# EAGLE design Corner Board Rev3 (EAGLE 9.6.2)

## Sheet 1 of 2
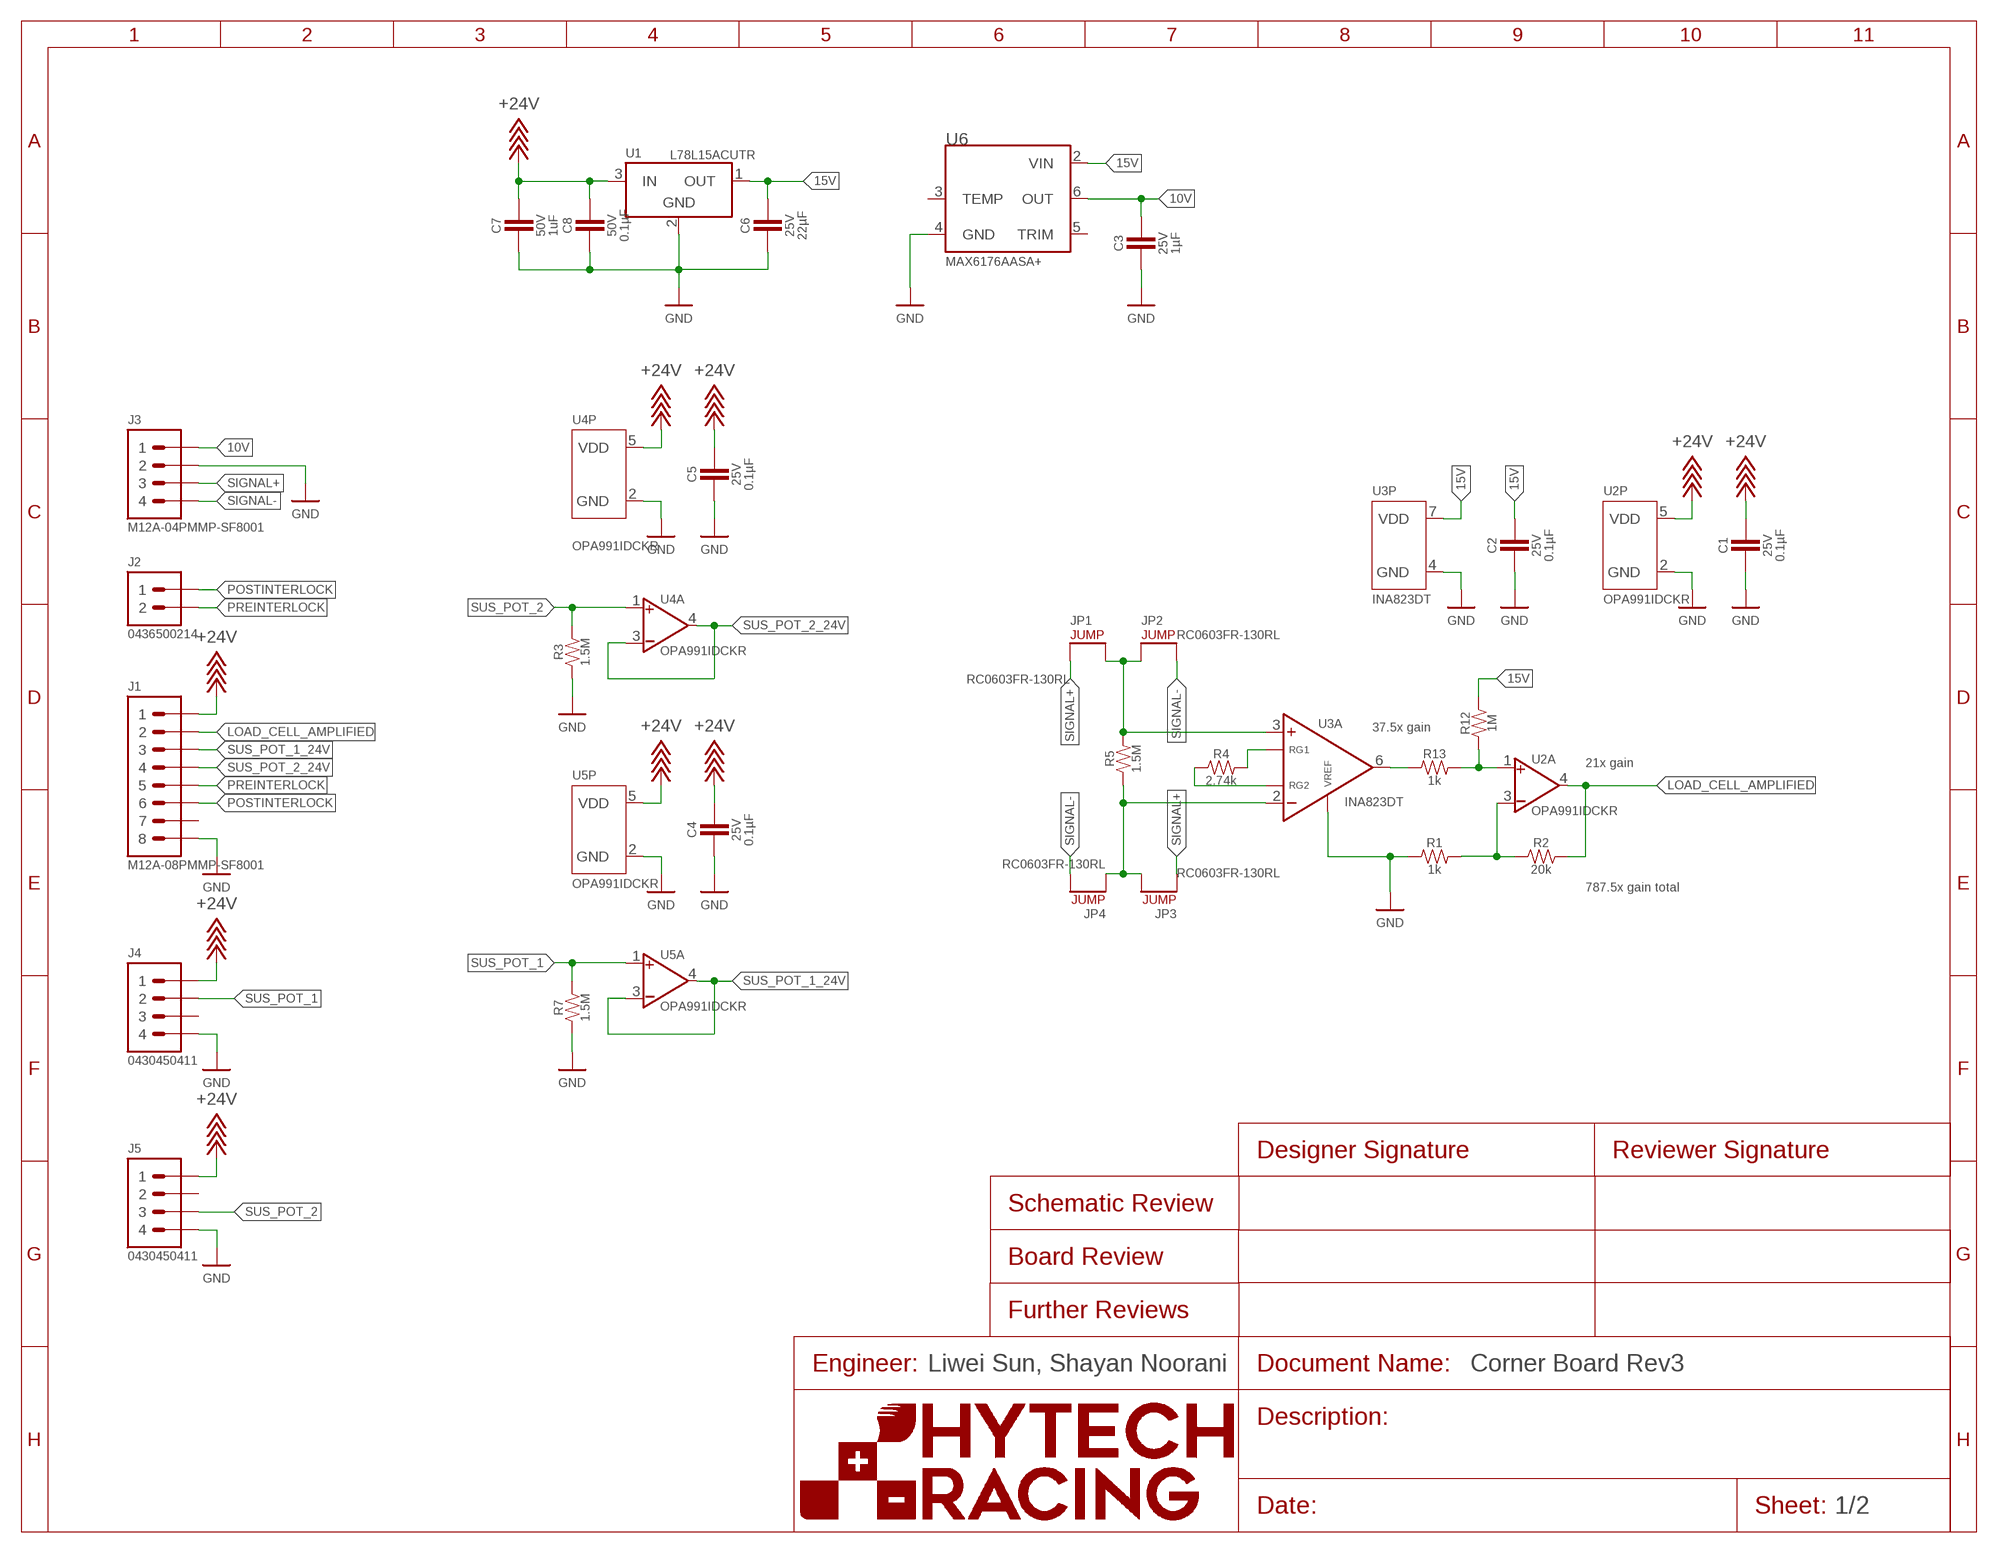
[diagram p0: schematic, sheet 1]
FRAME1 (FRAME): ENGINEER: Liwei Sun, Shayan Noorani

### Parts
C1  CAPACITOR_0603_25V_0.1UF  [0603-CAP]
C2  CAPACITOR_0603_25V_0.1UF  [0603-CAP]
C3  CAPACITOR_0603_25V_1UF  [0603-CAP]
C4  CAPACITOR_0603_25V_0.1UF  [0603-CAP]
C5  CAPACITOR_0603_25V_0.1UF  [0603-CAP]
C6  CAPACITOR_0805_25V_22UF  [0805-CAP]
C7  CAPACITOR_0603_50V_1UF  [0603-CAP]
C8  CAPACITOR_0603_50V_0.1UF  [0603-CAP]
J1  CONNECTOR-8_AMPHENOL_M12A_08PMMP_  [M12A-08PMMP]
J2  CONNECTOR-2_MICROFIT_SMD_RIGHTANGLE_02_SINGLE_BLACK  [MOLEX_MICROFIT_SMD_RIGHTANGLE_02_SINGLE]
J3  CONNECTOR-4_AMPHENOL_M12A_04PMMP_  [M12A-04PMMP]
J4  CONNECTOR-4_μF_S_RA_  [MOLEX_MICROFIT_SMD_RIGHTANGLE_04_DUAL]
J5  CONNECTOR-4_μF_S_RA_  [MOLEX_MICROFIT_SMD_RIGHTANGLE_04_DUAL]
JP1  JUMPER_0603_  [0603-RES]
JP2  JUMPER_0603_  [0603-RES]
JP3  JUMPER_0603_  [0603-RES]
JP4  JUMPER_0603_  [0603-RES]
R1  RESISTOR_0603_1K  [0603-RES]
R2  RESISTOR_0603_20K  [0603-RES]
R3  RESISTOR_0603_1.5M  [0603-RES]
R4  RESISTOR_0603_2.74K  [0603-RES]
R5  RESISTOR_0603_1.5M  [0603-RES]
R7  RESISTOR_0603_1.5M  [0603-RES]
R12  RESISTOR_0603_1M  [0603-RES]
R13  RESISTOR_0603_1K  [0603-RES]
U1  VOLTAGE_REGULATOR_SOT-89REVERSE_  [SOT-89]
U2  OPAMP_1_CHANNEL_OPA991  [SC-70-5]
U3  INA823DT  [SOIC-08(NARROW,0.15")]
U4  OPAMP_1_CHANNEL_OPA991  [SC-70-5]
U5  OPAMP_1_CHANNEL_OPA991  [SC-70-5]
U6  VOLTAGE_REFERENCE_SOIC-8_10V  [SOIC-08(NARROW,0.15")]

### Nets
10V: C3.1 J3.1 U6.6(OUT)
15V: C2.1 C6.1 R12.2 U1.1(OUT) U3.7(P:VDD) U6.2(VIN)
+24V: C1.1 C4.1 C5.1 C7.1 C8.1 J1.1 J4.1 J5.1 U1.3(IN) U2.5(P:VDD) U4.5(P:VDD) U5.5(P:VDD)
GND: C1.2 C2.2 C3.2 C4.2 C5.2 C6.2 C7.2 C8.2 J1.8 J3.2 J4.4 J5.4 R1.1 R3.1 R7.1 U1.2(GND) U2.2(P:GND) U3.4(P:GND) U3.5(A:VREF) U4.2(P:GND) U5.2(P:GND) U6.4(GND)
LOAD_CELL_AMPLIFIED: J1.2 R2.2 U2.4(A:VOUT)
N$1: R1.2 R2.1 U2.3(A:VIN-)
N$2: R4.2 U3.1(A:RG1)
N$3: R13.1 U3.6(A:VOUT)
N$4: R4.1 U3.8(A:RG2)
N$6: R12.1 R13.2 U2.1(A:VIN+)
N$7: JP3.2 JP4.1 R5.1 U3.2(A:VIN-)
N$9: JP1.2 JP2.1 R5.2 U3.3(A:VIN+)
POSTINTERLOCK: J1.6 J2.1
PREINTERLOCK: J1.5 J2.2
SIGNAL+: J3.3 JP1.1 JP3.1
SIGNAL-: J3.4 JP2.2 JP4.2
SUS_POT_1: J4.2 R7.2 U5.1(A:VIN+)
SUS_POT_1_24V: J1.3 U5.3(A:VIN-) U5.4(A:VOUT)
SUS_POT_2: J5.3 R3.2 U4.1(A:VIN+)
SUS_POT_2_24V: J1.4 U4.3(A:VIN-) U4.4(A:VOUT)
Unconnected: J1.7 J4.3 J5.2 U6.3(TEMP) U6.5(TRIM)

### Notes on the sheet
- 37.5x gain
- 21x gain
- 787.5x gain total

## Sheet 2 of 2
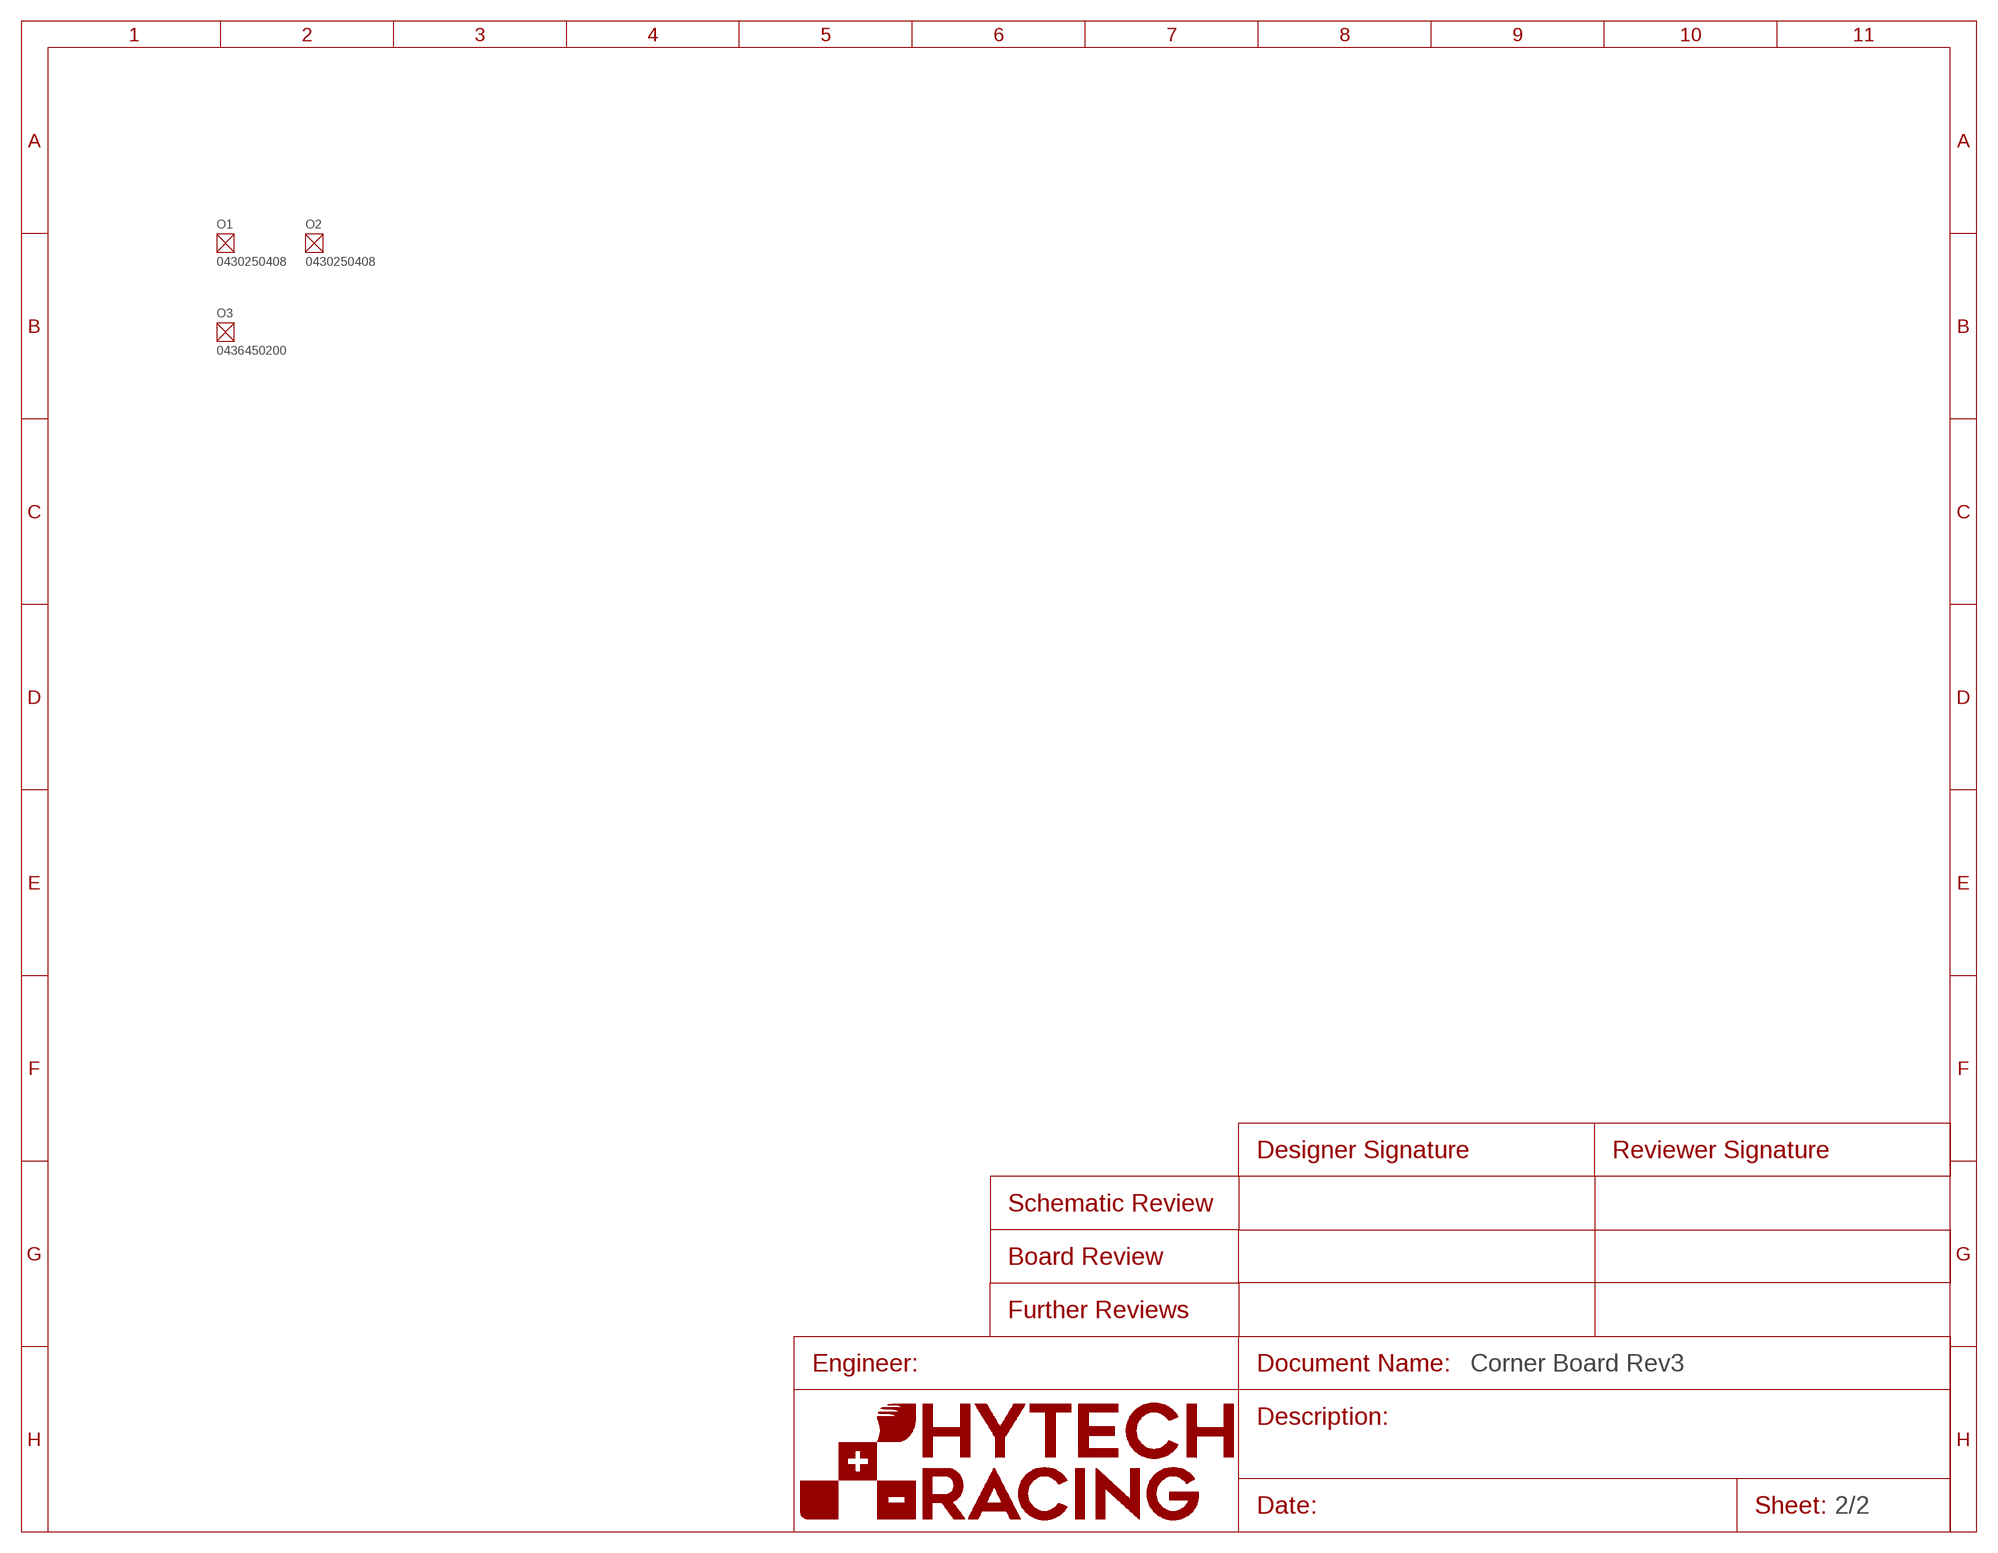
[diagram p1: schematic, sheet 2]
O1 (RECEPTACLE-4_MICROFIT): DKPN: WM11225-ND; MANUFACTURER: Molex; MOPN: 538-43025-0408; MPN: 0430250408
O2 (RECEPTACLE-4_MICROFIT): DKPN: WM11225-ND; MANUFACTURER: Molex; MOPN: 538-43025-0408; MPN: 0430250408
O3 (RECEPTACLE-2_MICROFIT): DKPN: WM1845-ND; MANUFACTURER: Molex; MOPN: 538-43645-0200; MPN: 0436450200

## Library data of the parts
C1 C2 C4 C5 = HyTechDevices:CAPACITOR_?_*: Capacitor, Non-Polarized VJ...1BC Series Datasheet <https://www.mouser.com/datasheet/2/427/vjw1bcbascomseries-1762447.pdf> Samsung Datasheet <https://www.mouser.com/datasheet/2/585/MLCC-1837944.pdf> Walsin Datasheet <https://www.mouser.com/datasheet/2/210/WTC_MLCC_General_Purpose-1534899.pdf> GRM188R61A226ME15D <https://www.mouser.com/datasheet/2/281/1/GRM188R61A226ME15_02A-1985787.pdf> GRM188R61E106MA73D <https://www.mouser.com/datasheet/2/281/1/GRM188R61E106MA73_01A-1985806.pdf> 885012006013 <https://www.mouser.com/datasheet/2/445/885012006013-1726946.pdf> 2220Y6300105KXTWS2 <https://www.mouser.com/datasheet/2/218/SMD_High_and_Std_StackiCap_P62-1825512.pdf> Yageo Class 2, X5R <https://www.mouser.com/datasheet/2/447/UPY_GPHC_X5R_4V_to_50V_26-1827097.pdf> TDK C Series <https://www.mouser.com/ProductDetail/TDK/C3216X5R1V226M160AC?qs=%2Fha2pyFadujbcx9jh7lYl%2F4NeMoXFhdc8AqVWNq4wW6M2y7zl6GzBuhgtI0ngznN> AVX Automotive MLCC <https://www.mouser.com/datasheet/2/40/AutoMLCC-777028.pdf> KEMET X7R Series <https://www.mouser.com/datasheet/2/212/KEM_C1002_X7R_SMD-1102033.pdf> Kyocera AVX <https://www.mouser.com/datasheet/2/40/C0GNP0_Dielectric-951274.pdf> GRM21BR61H <https://www.mouser.com/datasheet/2/281/1/GRM21BR61H106KE43_01A-1986884.pdf> C1812W104KDRACTU <https://www.mouser.com/datasheet/2/212/KEM_C1034_X7R_HV_ARC_SMD-1101730.pdf>; CAPACITANCE: 0.1µF; DKPN: 1276-1006-1-ND; MANUFACTURER: Samsung Electro-Mechanics; MOPN: 187-CL10B104KA8NNNC; MPN: CL10B104KA8NNNC; TOLERANCE: 10%; VOLTAGE: 25V
C3 = HyTechDevices:CAPACITOR_?_*: Capacitor, Non-Polarized VJ...1BC Series Datasheet <https://www.mouser.com/datasheet/2/427/vjw1bcbascomseries-1762447.pdf> Samsung Datasheet <https://www.mouser.com/datasheet/2/585/MLCC-1837944.pdf> Walsin Datasheet <https://www.mouser.com/datasheet/2/210/WTC_MLCC_General_Purpose-1534899.pdf> GRM188R61A226ME15D <https://www.mouser.com/datasheet/2/281/1/GRM188R61A226ME15_02A-1985787.pdf> GRM188R61E106MA73D <https://www.mouser.com/datasheet/2/281/1/GRM188R61E106MA73_01A-1985806.pdf> 885012006013 <https://www.mouser.com/datasheet/2/445/885012006013-1726946.pdf> 2220Y6300105KXTWS2 <https://www.mouser.com/datasheet/2/218/SMD_High_and_Std_StackiCap_P62-1825512.pdf> Yageo Class 2, X5R <https://www.mouser.com/datasheet/2/447/UPY_GPHC_X5R_4V_to_50V_26-1827097.pdf> TDK C Series <https://www.mouser.com/ProductDetail/TDK/C3216X5R1V226M160AC?qs=%2Fha2pyFadujbcx9jh7lYl%2F4NeMoXFhdc8AqVWNq4wW6M2y7zl6GzBuhgtI0ngznN> AVX Automotive MLCC <https://www.mouser.com/datasheet/2/40/AutoMLCC-777028.pdf> KEMET X7R Series <https://www.mouser.com/datasheet/2/212/KEM_C1002_X7R_SMD-1102033.pdf> Kyocera AVX <https://www.mouser.com/datasheet/2/40/C0GNP0_Dielectric-951274.pdf> GRM21BR61H <https://www.mouser.com/datasheet/2/281/1/GRM21BR61H106KE43_01A-1986884.pdf> C1812W104KDRACTU <https://www.mouser.com/datasheet/2/212/KEM_C1034_X7R_HV_ARC_SMD-1101730.pdf>; CAPACITANCE: 1µF; DKPN: 1276-1184-1-ND; MANUFACTURER: Samsung Electro-Mechanics; MOPN: 187-CL10B105KA8NNNC; MPN: CL10B105KA8NNNC; TOLERANCE: 10%; VOLTAGE: 25V
C6 = HyTechDevices:CAPACITOR_?_*: Capacitor, Non-Polarized VJ...1BC Series Datasheet <https://www.mouser.com/datasheet/2/427/vjw1bcbascomseries-1762447.pdf> Samsung Datasheet <https://www.mouser.com/datasheet/2/585/MLCC-1837944.pdf> Walsin Datasheet <https://www.mouser.com/datasheet/2/210/WTC_MLCC_General_Purpose-1534899.pdf> GRM188R61A226ME15D <https://www.mouser.com/datasheet/2/281/1/GRM188R61A226ME15_02A-1985787.pdf> GRM188R61E106MA73D <https://www.mouser.com/datasheet/2/281/1/GRM188R61E106MA73_01A-1985806.pdf> 885012006013 <https://www.mouser.com/datasheet/2/445/885012006013-1726946.pdf> 2220Y6300105KXTWS2 <https://www.mouser.com/datasheet/2/218/SMD_High_and_Std_StackiCap_P62-1825512.pdf> Yageo Class 2, X5R <https://www.mouser.com/datasheet/2/447/UPY_GPHC_X5R_4V_to_50V_26-1827097.pdf> TDK C Series <https://www.mouser.com/ProductDetail/TDK/C3216X5R1V226M160AC?qs=%2Fha2pyFadujbcx9jh7lYl%2F4NeMoXFhdc8AqVWNq4wW6M2y7zl6GzBuhgtI0ngznN> AVX Automotive MLCC <https://www.mouser.com/datasheet/2/40/AutoMLCC-777028.pdf> KEMET X7R Series <https://www.mouser.com/datasheet/2/212/KEM_C1002_X7R_SMD-1102033.pdf> Kyocera AVX <https://www.mouser.com/datasheet/2/40/C0GNP0_Dielectric-951274.pdf> GRM21BR61H <https://www.mouser.com/datasheet/2/281/1/GRM21BR61H106KE43_01A-1986884.pdf> C1812W104KDRACTU <https://www.mouser.com/datasheet/2/212/KEM_C1034_X7R_HV_ARC_SMD-1101730.pdf>; CAPACITANCE: 22µF; DKPN: 311-1903-1-ND; MANUFACTURER: Yageo; MOPN: 603-CC805MKX5R8BB226; MPN: CC0805MKX5R8BB226; TOLERANCE: 20%; VOLTAGE: 25V
C7 = HyTechDevices:CAPACITOR_?_*: Capacitor, Non-Polarized VJ...1BC Series Datasheet <https://www.mouser.com/datasheet/2/427/vjw1bcbascomseries-1762447.pdf> Samsung Datasheet <https://www.mouser.com/datasheet/2/585/MLCC-1837944.pdf> Walsin Datasheet <https://www.mouser.com/datasheet/2/210/WTC_MLCC_General_Purpose-1534899.pdf> GRM188R61A226ME15D <https://www.mouser.com/datasheet/2/281/1/GRM188R61A226ME15_02A-1985787.pdf> GRM188R61E106MA73D <https://www.mouser.com/datasheet/2/281/1/GRM188R61E106MA73_01A-1985806.pdf> 885012006013 <https://www.mouser.com/datasheet/2/445/885012006013-1726946.pdf> 2220Y6300105KXTWS2 <https://www.mouser.com/datasheet/2/218/SMD_High_and_Std_StackiCap_P62-1825512.pdf> Yageo Class 2, X5R <https://www.mouser.com/datasheet/2/447/UPY_GPHC_X5R_4V_to_50V_26-1827097.pdf> TDK C Series <https://www.mouser.com/ProductDetail/TDK/C3216X5R1V226M160AC?qs=%2Fha2pyFadujbcx9jh7lYl%2F4NeMoXFhdc8AqVWNq4wW6M2y7zl6GzBuhgtI0ngznN> AVX Automotive MLCC <https://www.mouser.com/datasheet/2/40/AutoMLCC-777028.pdf> KEMET X7R Series <https://www.mouser.com/datasheet/2/212/KEM_C1002_X7R_SMD-1102033.pdf> Kyocera AVX <https://www.mouser.com/datasheet/2/40/C0GNP0_Dielectric-951274.pdf> GRM21BR61H <https://www.mouser.com/datasheet/2/281/1/GRM21BR61H106KE43_01A-1986884.pdf> C1812W104KDRACTU <https://www.mouser.com/datasheet/2/212/KEM_C1034_X7R_HV_ARC_SMD-1101730.pdf>; CAPACITANCE: 1uF; DKPN: 587-2400-2-ND; MANUFACTURER: Taiyo Yuden; MOPN: 963-UMK107BJ105KA-T; MPN: UMK107BJ105KA-T; TOLERANCE: 10%; VOLTAGE: 50V
C8 = HyTechDevices:CAPACITOR_?_*: Capacitor, Non-Polarized VJ...1BC Series Datasheet <https://www.mouser.com/datasheet/2/427/vjw1bcbascomseries-1762447.pdf> Samsung Datasheet <https://www.mouser.com/datasheet/2/585/MLCC-1837944.pdf> Walsin Datasheet <https://www.mouser.com/datasheet/2/210/WTC_MLCC_General_Purpose-1534899.pdf> GRM188R61A226ME15D <https://www.mouser.com/datasheet/2/281/1/GRM188R61A226ME15_02A-1985787.pdf> GRM188R61E106MA73D <https://www.mouser.com/datasheet/2/281/1/GRM188R61E106MA73_01A-1985806.pdf> 885012006013 <https://www.mouser.com/datasheet/2/445/885012006013-1726946.pdf> 2220Y6300105KXTWS2 <https://www.mouser.com/datasheet/2/218/SMD_High_and_Std_StackiCap_P62-1825512.pdf> Yageo Class 2, X5R <https://www.mouser.com/datasheet/2/447/UPY_GPHC_X5R_4V_to_50V_26-1827097.pdf> TDK C Series <https://www.mouser.com/ProductDetail/TDK/C3216X5R1V226M160AC?qs=%2Fha2pyFadujbcx9jh7lYl%2F4NeMoXFhdc8AqVWNq4wW6M2y7zl6GzBuhgtI0ngznN> AVX Automotive MLCC <https://www.mouser.com/datasheet/2/40/AutoMLCC-777028.pdf> KEMET X7R Series <https://www.mouser.com/datasheet/2/212/KEM_C1002_X7R_SMD-1102033.pdf> Kyocera AVX <https://www.mouser.com/datasheet/2/40/C0GNP0_Dielectric-951274.pdf> GRM21BR61H <https://www.mouser.com/datasheet/2/281/1/GRM21BR61H106KE43_01A-1986884.pdf> C1812W104KDRACTU <https://www.mouser.com/datasheet/2/212/KEM_C1034_X7R_HV_ARC_SMD-1101730.pdf>; CAPACITANCE: 0.1µF; DKPN: 311-1344-1-ND; MANUFACTURER: Yageo; MOPN: 603-CC603KRX7R9BB104; MPN: CC0603KRX7R9BB104; TOLERANCE: 10%; VOLTAGE: 50V
J1 = HyTechDevices:CONNECTOR-8_?_*: 8 Pin Connector; DKPN: 1754-1026-ND; MANUFACTURER: Amphenol LTW; MOPN: 523-M12A08PMMPSF8001; MPN: M12A-08PMMP-SF8001
J2 = HyTechDevices:CONNECTOR-2_?_*: 2 Pin Connector; DKPN: WM14310CT-ND; MANUFACTURER: Molex; MOPN: 538-43650-0214; MPN: 0436500214
J3 = HyTechDevices:CONNECTOR-4_?_*: 4 Pin Connector; DKPN: 1754-1007-ND; MANUFACTURER: Amphenol; MPN: M12A-04PMMP-SF8001
J4 J5 = HyTechDevices:CONNECTOR-4_?_*: 4 Pin Connector; DKPN: WM1832CT-ND; MANUFACTURER: Molex; MOPN: 538-0430450411; MPN: 0430450411
JP1-JP4 = HyTechDevices:JUMPER_?_*: 2 Pin Connector; DKPN: 13-RC0603FR-130RLTR-ND; MANUFACTURER: YAGEO; MOPN: 603-RC0603FR-130RL; MPN: RC0603FR-130RL
R1 R13 = HyTechDevices:RESISTOR_?_*: Resistor PWR163 Series <https://www.mouser.com/datasheet/2/54/pwr163-777985.pdf> AC Series <https://www.mouser.com/datasheet/2/447/Yageo_PYu_AC_51_RoHS_L_7_1714230-1874691.pdf> PU Series <https://www.mouser.com/datasheet/2/447/PYu-PU_51_RoHS_L_6-1504619.pdf> ERA Series <https://www.mouser.com/datasheet/2/315/AOA0000C307-1149632.pdf> PWR263 Series <https://www.mouser.com/datasheet/2/54/pwr263s_35-778069.pdf> KTR Series <https://www.mouser.com/datasheet/2/348/ROHM_S_A0011075115_1-2563276.pdf> RC Series <https://www.mouser.com/datasheet/2/447/Yageo_03_18_2021_PYu_RC_Group_51_RoHS_L_11-2199992.pdf> ERJ PB3, PB6 Series <https://www.mouser.com/datasheet/2/315/AOA0000C328-1530132.pdf> ERJ PA2, P03, PA3, P06, P08, P14 Series <https://www.mouser.com/datasheet/2/315/AOA0000C331-1141874.pdf> B20 Series <https://www.ohmite.com/assets/docs/res_200.pdf?r=false> TE Connectivity/Holsworthy RN73 Series <https://www.mouser.com/datasheet/2/418/4/NG_DS_1773270_M-604713.pdf> Vishay Dale D/CRCW e3 <https://www.mouser.com/datasheet/2/427/dcrcwe3-1762152.pdf> Ohmite B20 <https://www.ohmite.com/assets/docs/res_200.pdf?r=false>; DKPN: 1712-CPF-A-0603B1K0ETR-ND; MANUFACTURER: TE Connectivity Passive Product; MOPN: 279-CPF-A-0603B1K0E; MPN: CPF-A-0603B1K0E; POWER: 0.0625W; RESISTANCE: 1k; TOLERANCE: 0.1%; VOLTAGE_CONTINUOUS: 7.9V; VOLTAGE_MAX: 50V
R2 = HyTechDevices:RESISTOR_?_*: Resistor PWR163 Series <https://www.mouser.com/datasheet/2/54/pwr163-777985.pdf> AC Series <https://www.mouser.com/datasheet/2/447/Yageo_PYu_AC_51_RoHS_L_7_1714230-1874691.pdf> PU Series <https://www.mouser.com/datasheet/2/447/PYu-PU_51_RoHS_L_6-1504619.pdf> ERA Series <https://www.mouser.com/datasheet/2/315/AOA0000C307-1149632.pdf> PWR263 Series <https://www.mouser.com/datasheet/2/54/pwr263s_35-778069.pdf> KTR Series <https://www.mouser.com/datasheet/2/348/ROHM_S_A0011075115_1-2563276.pdf> RC Series <https://www.mouser.com/datasheet/2/447/Yageo_03_18_2021_PYu_RC_Group_51_RoHS_L_11-2199992.pdf> ERJ PB3, PB6 Series <https://www.mouser.com/datasheet/2/315/AOA0000C328-1530132.pdf> ERJ PA2, P03, PA3, P06, P08, P14 Series <https://www.mouser.com/datasheet/2/315/AOA0000C331-1141874.pdf> B20 Series <https://www.ohmite.com/assets/docs/res_200.pdf?r=false> TE Connectivity/Holsworthy RN73 Series <https://www.mouser.com/datasheet/2/418/4/NG_DS_1773270_M-604713.pdf> Vishay Dale D/CRCW e3 <https://www.mouser.com/datasheet/2/427/dcrcwe3-1762152.pdf> Ohmite B20 <https://www.ohmite.com/assets/docs/res_200.pdf?r=false>; DKPN: 311-20.0KHRTR-ND; MANUFACTURER: Yageo; MOPN: 603-RC0603FR-0720KL; MPN: RC0603FR-0720KL; POWER: 0.1 W; RESISTANCE: 20k; TOLERANCE: 1%; VOLTAGE_CONTINUOUS: 44.72V; VOLTAGE_MAX: 75V
R3 R5 R7 = HyTechDevices:RESISTOR_?_*: Resistor PWR163 Series <https://www.mouser.com/datasheet/2/54/pwr163-777985.pdf> AC Series <https://www.mouser.com/datasheet/2/447/Yageo_PYu_AC_51_RoHS_L_7_1714230-1874691.pdf> PU Series <https://www.mouser.com/datasheet/2/447/PYu-PU_51_RoHS_L_6-1504619.pdf> ERA Series <https://www.mouser.com/datasheet/2/315/AOA0000C307-1149632.pdf> PWR263 Series <https://www.mouser.com/datasheet/2/54/pwr263s_35-778069.pdf> KTR Series <https://www.mouser.com/datasheet/2/348/ROHM_S_A0011075115_1-2563276.pdf> RC Series <https://www.mouser.com/datasheet/2/447/Yageo_03_18_2021_PYu_RC_Group_51_RoHS_L_11-2199992.pdf> ERJ PB3, PB6 Series <https://www.mouser.com/datasheet/2/315/AOA0000C328-1530132.pdf> ERJ PA2, P03, PA3, P06, P08, P14 Series <https://www.mouser.com/datasheet/2/315/AOA0000C331-1141874.pdf> B20 Series <https://www.ohmite.com/assets/docs/res_200.pdf?r=false> TE Connectivity/Holsworthy RN73 Series <https://www.mouser.com/datasheet/2/418/4/NG_DS_1773270_M-604713.pdf> Vishay Dale D/CRCW e3 <https://www.mouser.com/datasheet/2/427/dcrcwe3-1762152.pdf> Ohmite B20 <https://www.ohmite.com/assets/docs/res_200.pdf?r=false>; DKPN: 311-1.50MHRCT-ND; MANUFACTURER: Yageo; MOPN: 603-RC0603FR-071M5L; MPN: RC0603FR-071M5L; POWER: 0.1W; RESISTANCE: 1.5M; TOLERANCE: 1%; VOLTAGE_CONTINUOUS: 75V; VOLTAGE_MAX: 75V
R4 = HyTechDevices:RESISTOR_?_*: Resistor PWR163 Series <https://www.mouser.com/datasheet/2/54/pwr163-777985.pdf> AC Series <https://www.mouser.com/datasheet/2/447/Yageo_PYu_AC_51_RoHS_L_7_1714230-1874691.pdf> PU Series <https://www.mouser.com/datasheet/2/447/PYu-PU_51_RoHS_L_6-1504619.pdf> ERA Series <https://www.mouser.com/datasheet/2/315/AOA0000C307-1149632.pdf> PWR263 Series <https://www.mouser.com/datasheet/2/54/pwr263s_35-778069.pdf> KTR Series <https://www.mouser.com/datasheet/2/348/ROHM_S_A0011075115_1-2563276.pdf> RC Series <https://www.mouser.com/datasheet/2/447/Yageo_03_18_2021_PYu_RC_Group_51_RoHS_L_11-2199992.pdf> ERJ PB3, PB6 Series <https://www.mouser.com/datasheet/2/315/AOA0000C328-1530132.pdf> ERJ PA2, P03, PA3, P06, P08, P14 Series <https://www.mouser.com/datasheet/2/315/AOA0000C331-1141874.pdf> B20 Series <https://www.ohmite.com/assets/docs/res_200.pdf?r=false> TE Connectivity/Holsworthy RN73 Series <https://www.mouser.com/datasheet/2/418/4/NG_DS_1773270_M-604713.pdf> Vishay Dale D/CRCW e3 <https://www.mouser.com/datasheet/2/427/dcrcwe3-1762152.pdf> Ohmite B20 <https://www.ohmite.com/assets/docs/res_200.pdf?r=false>; DKPN: P20020CT-ND; MANUFACTURER: Panasonic Electronic Components; MOPN: 667-ERJ-PB3B2741V; MPN: ERJ-PB3B2741V; POWER: 0.2W; RESISTANCE: 2.74k; TOLERANCE: 0.1%; VOLTAGE_CONTINUOUS: 23.41V; VOLTAGE_MAX: 150V
R12 = HyTechDevices:RESISTOR_?_*: Resistor PWR163 Series <https://www.mouser.com/datasheet/2/54/pwr163-777985.pdf> AC Series <https://www.mouser.com/datasheet/2/447/Yageo_PYu_AC_51_RoHS_L_7_1714230-1874691.pdf> PU Series <https://www.mouser.com/datasheet/2/447/PYu-PU_51_RoHS_L_6-1504619.pdf> ERA Series <https://www.mouser.com/datasheet/2/315/AOA0000C307-1149632.pdf> PWR263 Series <https://www.mouser.com/datasheet/2/54/pwr263s_35-778069.pdf> KTR Series <https://www.mouser.com/datasheet/2/348/ROHM_S_A0011075115_1-2563276.pdf> RC Series <https://www.mouser.com/datasheet/2/447/Yageo_03_18_2021_PYu_RC_Group_51_RoHS_L_11-2199992.pdf> ERJ PB3, PB6 Series <https://www.mouser.com/datasheet/2/315/AOA0000C328-1530132.pdf> ERJ PA2, P03, PA3, P06, P08, P14 Series <https://www.mouser.com/datasheet/2/315/AOA0000C331-1141874.pdf> B20 Series <https://www.ohmite.com/assets/docs/res_200.pdf?r=false> TE Connectivity/Holsworthy RN73 Series <https://www.mouser.com/datasheet/2/418/4/NG_DS_1773270_M-604713.pdf> Vishay Dale D/CRCW e3 <https://www.mouser.com/datasheet/2/427/dcrcwe3-1762152.pdf> Ohmite B20 <https://www.ohmite.com/assets/docs/res_200.pdf?r=false>; DKPN: 311-1.00MHRCT-ND; MANUFACTURER: Yageo; MOPN: 603-RC0603FR-071ML; MPN: RC0603FR-071ML; POWER: 0.1W; RESISTANCE: 1M; TOLERANCE: 1%; VOLTAGE_CONTINUOUS: 75V; VOLTAGE_MAX: 75V
U1 = HyTechDevices:VOLTAGE_REGULATOR_?_*: Voltage Regulators LDL1117S50R Datasheet <https://www.mouser.com/datasheet/2/389/dm00366442-1799212.pdf> NCP785AH120T1G <https://www.mouser.com/datasheet/2/308/NCP785A_D-1812704.pdf> LMS8117A Datasheet <https://www.ti.com/lit/ds/symlink/lms8117a.pdf?HQS> ST732M50R Datasheet <https://www.mouser.com/datasheet/2/389/st732-1830546.pdf> LM2937IMPX-10/NOPB Datasheet <https://www.ti.com/lit/ds/symlink/lm2937.pdf>; DKPN: 497-7279-2-ND; MANUFACTURER: STMicroelectronics; MOPN: 511-L78L15ACU-TR; MPN: L78L15ACUTR
U2 U4 U5 = HyTechDevices:OPAMP_1_CHANNEL_*: Op-Amp 1 Channel OPA991 Datasheet <https://www.ti.com/lit/ds/symlink/opa991.pdf?ts=1615503614502> Note: OPA991 is also a comparator; DKPN: 296-OPA991IDCKRCT-ND; MANUFACTURER: Texas Instruments; MOPN: 595-OPA991IDCKR; MPN: OPA991IDCKR
U3 = HyTechDevices:INA823*: INA823 Precision, Low-Power, Wide-Supply (2.7-V to 36-V) Instrumentation Amplifier Datasheet <https://www.ti.com/lit/ds/symlink/ina823.pdf?HQS=dis-mous-null-mousermode-dsf-pf-null-wwe&ts=1664732413637&ref_url=https%253A%252F%252Fwww.ti.com%252Fgeneral%252Fdocs%252Fsuppproductinfo.tsp%253FdistId%253D26%2526gotoUrl%253Dhttps%253A%252F%252Fwww.ti.com%252Flit%252Fgpn%252Fina823>; DKPN: 296-INA823DTCT-ND; MANUFACTURER: Texas Instruments; MOPN: 595-INA823DT; MPN: INA823DT
U6 = HyTechDevices:VOLTAGE_REFERENCE_?_*: MAX6173–MAX6177 Datasheet <https://www.mouser.com/datasheet/2/256/MAX6173-MAX6177-1515925.pdf>; DKPN: MAX6176AASA+-ND; MANUFACTURER: Maxim Integrated; MOPN: 700-MAX6176AASA; MPN: MAX6176AASA+

## Board
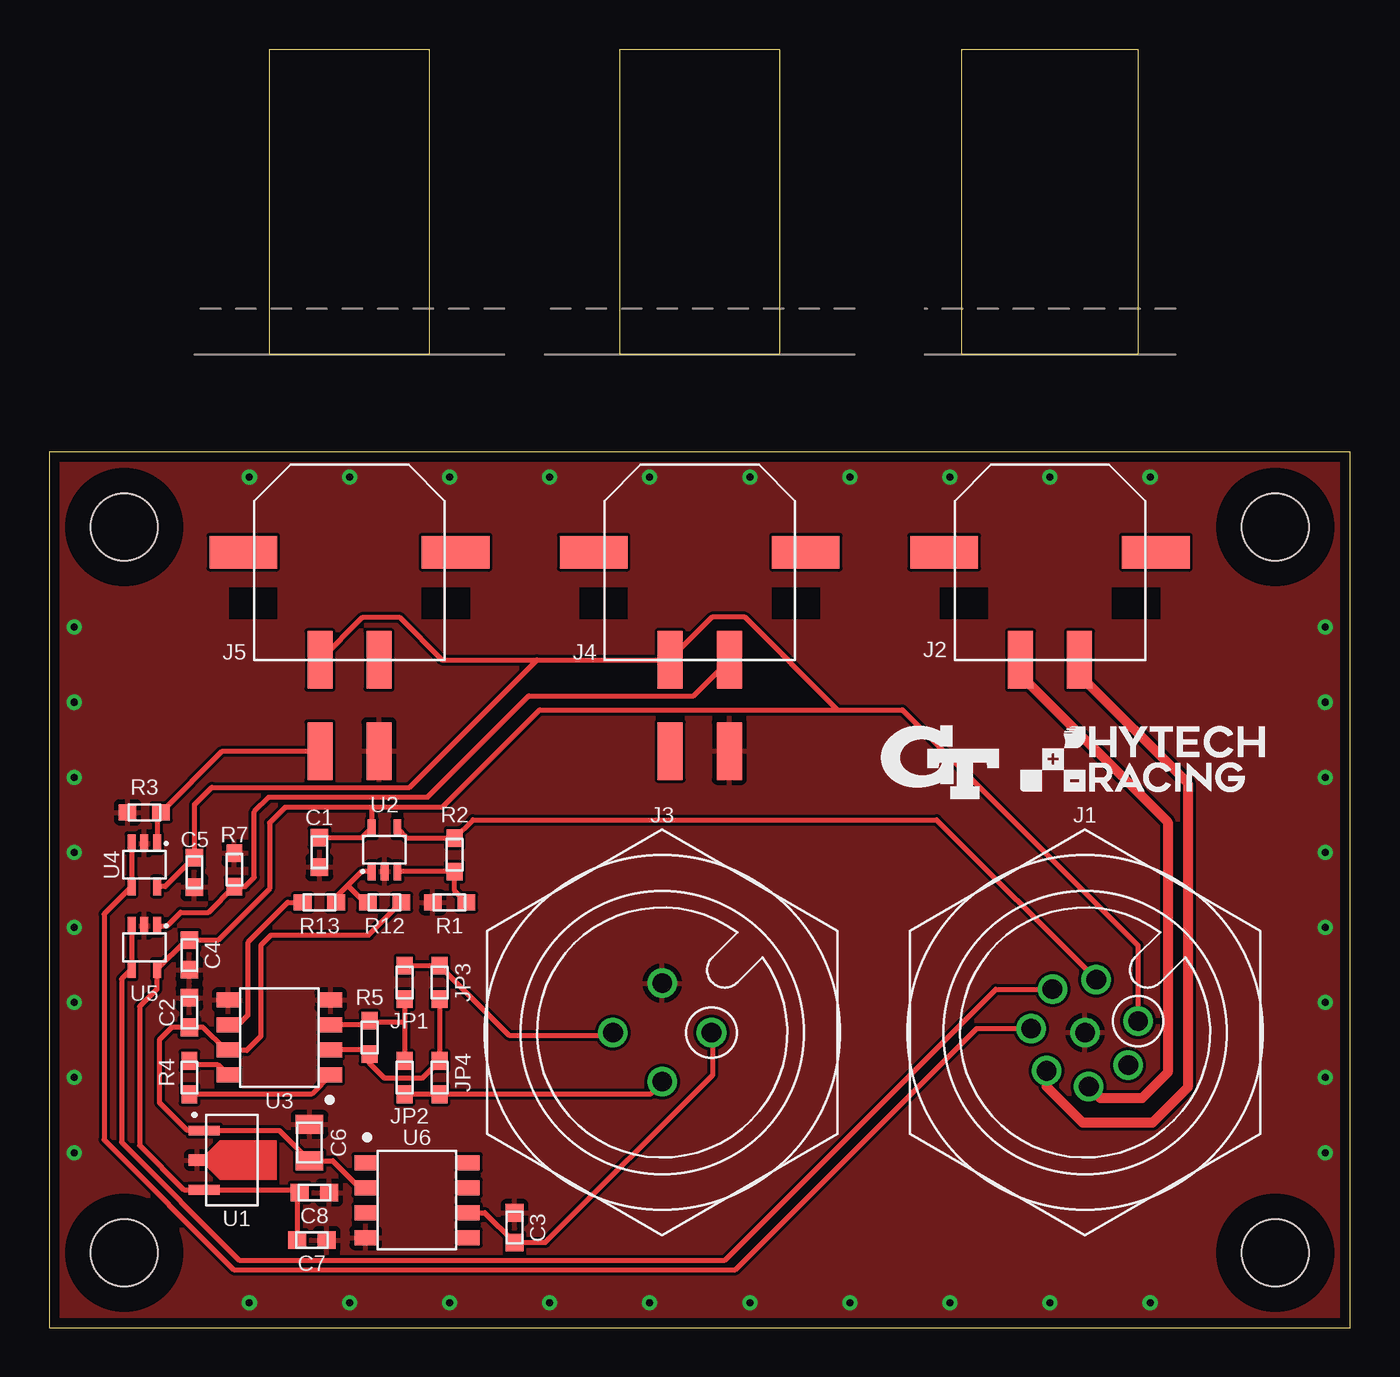
[diagram p2: board, top side]
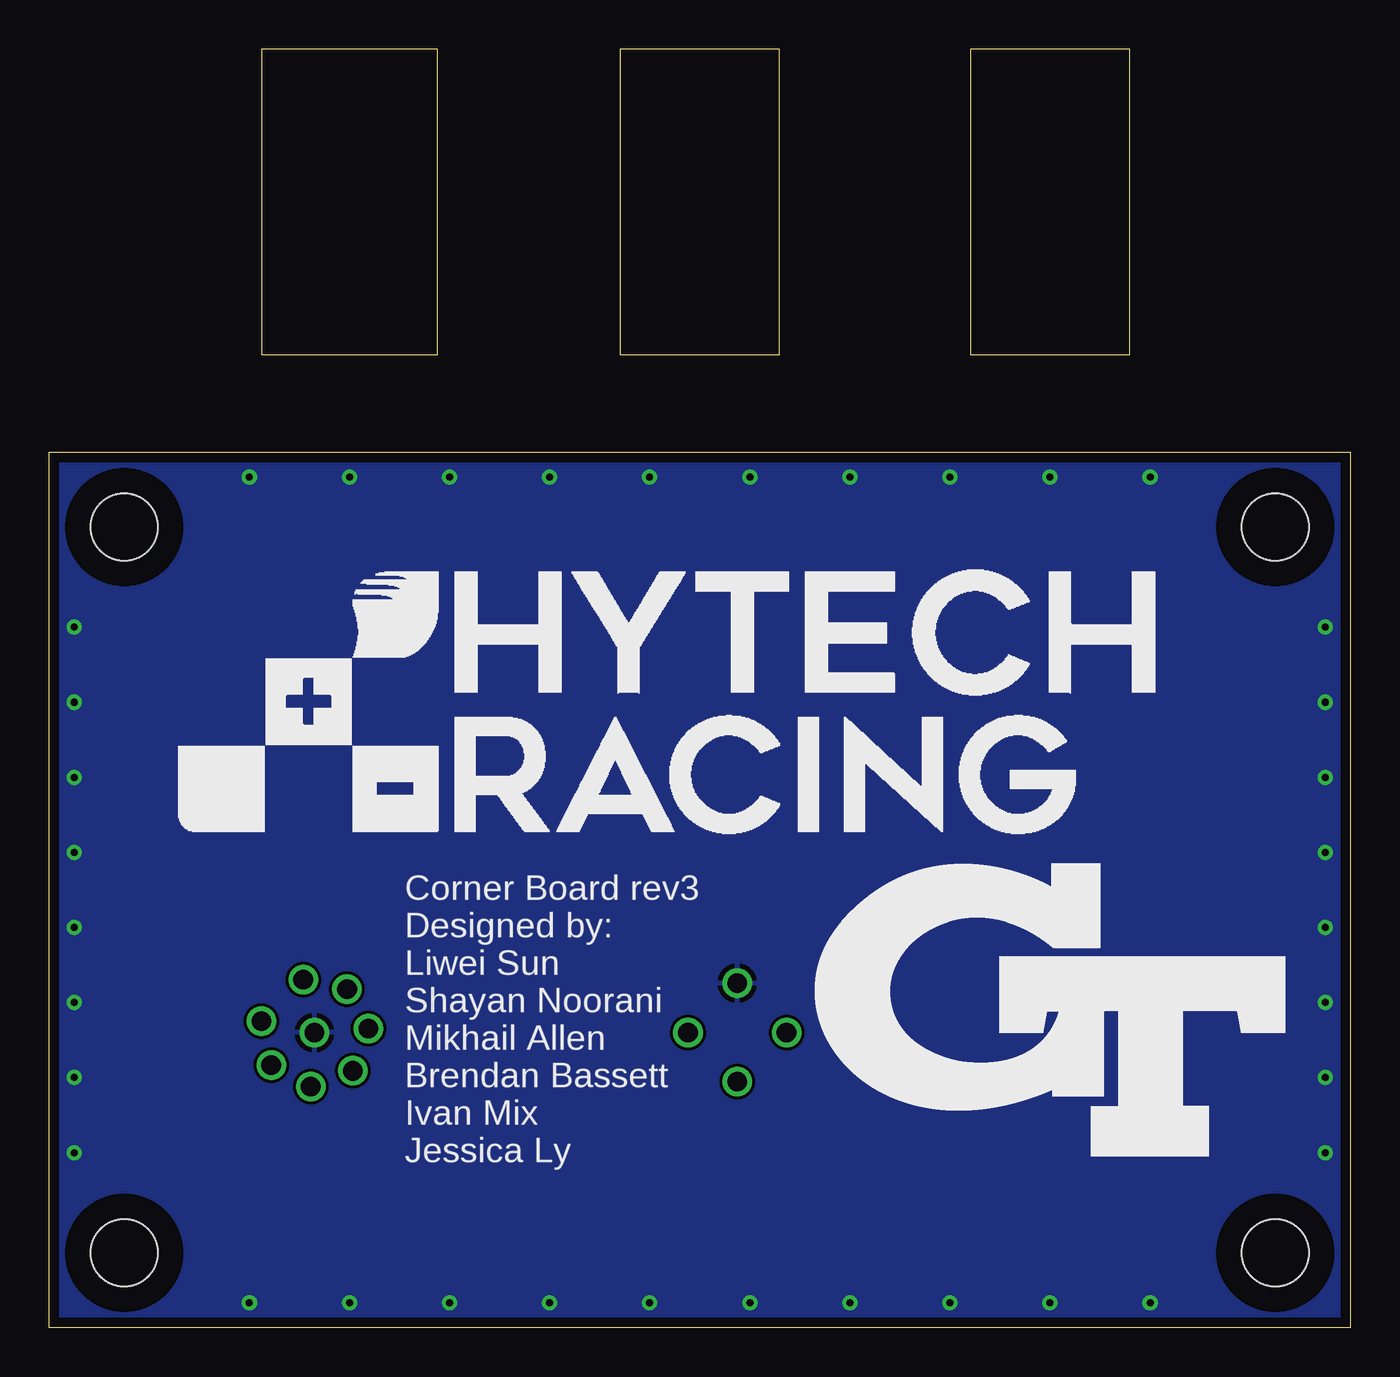
[diagram p3: board, bottom side, seen from below]

Size 66.04 x 44.45 mm. Coordinates in mm from the lower left corner, seen from the top.
Outline: 0,0 66.04,0 66.04,44.45 0,44.45 0,0
Copper layers (1*16): Top 0.035mm / dielectric 1.53mm / Bottom 0.035mm
Design rules "HyTech Default (2 Layer)": minimum track width 6mil, minimum drill 14mil, track to track 6mil, track to pad 6mil, pad to pad 6mil, via to via 20mil, smd to smd 6mil, copper to edge 20mil, drill to drill 21mil, minimum pad ring 7mil, minimum via ring 8mil, stop-mask expansion 6mil, vias tented up to drill 30mil, thermal gap 10mil

### Footprints (pad centres in the part's own frame; a part is rotated, then mirrored left to right if it is on the bottom)
0603-CAP = smd 0.9 x 0.9: 1 -0.75,0; 2 0.75,0
0805-CAP = smd 0.95 x 1.4: 1 -0.925,0; 2 0.925,0
M12A-08PMMP = drill 1: 1 2.69,0.572; 2 0.572,2.69; 3 -1.655,2.196; 4 -2.743,0.192; 5 -1.945,-1.945; 6 0.192,-2.743; 7 2.196,-1.655; 8 0,0
MOLEX_MICROFIT_SMD_RIGHTANGLE_02_SINGLE = smd 1.27 x 2.921: 1 1.499,5.474; 2 -1.499,5.474 | smd 3.429 x 1.651: PAD1 5.372,0; PAD2 -5.372,0
M12A-04PMMP = drill 1: 1 2.5,0; 2 0,2.5; 3 -2.5,0; 4 0,-2.5
MOLEX_MICROFIT_SMD_RIGHTANGLE_04_DUAL = smd 1.27 x 2.921: 1 1.5,5.474; 2 -1.5,5.474; 3 1.5,10.097; 4 -1.5,10.097 | smd 3.429 x 1.651: PAD1 5.386,0; PAD2 -5.386,0
0603-RES = smd 0.9 x 0.8: 1 -0.85,0; 2 0.85,0
SOT-89 = smd 0.5 x 1.57: 1 -1.5,0; 3 1.5,0 | smd 0.58 x 0.86: 2 0,-0.355
SC-70-5 = smd 0.4 x 0.9: 1 -0.65,-1.1; 2 0,-1.1; 3 0.65,-1.1; 4 0.65,1.1; 5 -0.65,1.1
SOIC-08(NARROW,0.15") = smd 0.762 x 1.143: 1 -1.905,-2.603; 2 -0.635,-2.603; 3 0.635,-2.603; 4 1.905,-2.603; 5 1.905,2.603; 6 0.635,2.603; 7 -0.635,2.603; 8 -1.905,2.603
MOUNTING_M3 = hole 3.4: 0,0

### Placement (x,y rotation side)
C1  13.72,24.13 270 top
C2  7.11,16 90 top
C3  23.62,5.08 90 top
C4  7.11,18.92 270 top
C5  7.37,23.11 270 top
C6  13.21,9.4 90 top
C7  13.34,4.45 0 top
C8  13.46,6.86 0 top
J1  52.58,14.99 0 top
J2  50.8,39.37 180 top
J3  31.11,14.99 0 top
J4  33.02,39.37 180 top
J5  15.24,39.37 180 top
JP1  18.03,17.53 270 top
JP2  18.03,12.7 270 top
JP3  19.81,17.53 270 top
JP4  19.81,12.7 270 top
R1  20.32,21.59 0 top
R2  20.57,24 90 top
R3  4.83,26.16 0 top
R4  7.11,12.7 270 top
R5  16.26,14.73 90 top
R7  9.4,23.24 270 top
R12  17.02,21.59 0 top
R13  13.72,21.59 0 top
U1  7.87,8.51 270 top
U2  17.02,24.26 0 top
U3  11.68,14.73 90 top
U4  4.83,23.5 180 top
U5  4.83,19.3 180 top
U6  18.67,6.48 270 top
U$6  [LOGO_HYTECH_LARGE]  59.56,25.15 0 bottom
U$7  [MOUNTING_M3]  3.81,40.64 0 top
U$8  [MOUNTING_M3]  62.23,40.64 0 top
U$9  [MOUNTING_M3]  62.23,3.81 0 top
U$10  [MOUNTING_M3]  3.81,3.81 0 top
U$14  [LOGO_GT_SMALL]  45.21,28.7 0 top
U$15  [LOGO_GT_LARGE]  15.24,16.13 0 bottom
U$19  [LOGO_HYTECH_SMALL]  49.28,27.18 0 top

### Tracks (layer width: path | path; a pad name or v marks a point on that pad's centre or on a via)
10V
  Top 0.254: U6.6 22.11,5.84 C3.1 25.18,4.33 33.67,12.82 33.67,14.93 J3.1
15V
  Top 0.254: U6.2 15.75,7.11 14.39,8.47 C6.1 11.67,10.01 U1.1 7.85,10.03 6.99,10.03 5.59,11.43 5.59,14.62 6.22,15.25 C2.1 7.8,15.25 8.95,14.1 U3.7 9.11,14.07 10.02,14.07 10.76,14.81 10.76,19.43 11.26,19.94 16.22,19.94 R12.2
+24V
  Top 0.254: 40.01,31.37 35.31,36.07 33.65,36.07 31.52,33.94 J4.1 24.75,33.9 | 16.37,26.42 19.94,26.42 24.89,31.37 40.01,31.37 | J1.1 55.27,19.41 43.31,31.37 40.01,31.37 | 16.37,26.42 U2.5 15.89,24.88 C1.1 | C7.1 12.59,6.75 12.71,6.75 C8.1 12.56,7.01 U1.3 6.83,7.01 4.59,9.26 4.59,16.3 5.48,17.19 U5.5 6.95,19.67 C4.1 8.56,19.67 11.18,22.29 11.18,25.63 11.97,26.42 16.37,26.42 | U4.5 5.9,22.39 C5.1 7.37,26.54 8.26,27.43 18.29,27.43 24.75,33.9 | J5.1 15.91,36.07 17.78,36.07 19.95,33.9 24.75,33.9
GND  (via drill 0.36)
  other vias: 1.27,8.89 1.27,35.56 1.27,12.7 1.27,16.51 1.27,27.94 1.27,31.75 1.27,24.13 1.27,20.32 64.77,8.89 64.77,35.56 64.77,12.7 64.77,16.51 64.77,27.94 64.77,31.75 64.77,24.13 64.77,20.32 10.16,1.27 35.56,1.27 15.24,1.27 20.32,1.27 30.48,1.27 40.64,1.27 45.72,1.27 50.8,1.27 55.88,1.27 25.4,1.27 10.16,43.18 35.56,43.18 15.24,43.18 20.32,43.18 30.48,43.18 40.64,43.18 45.72,43.18 50.8,43.18 55.88,43.18 25.4,43.18
  pour Top: -0.25,44.7 -0.25,-0.25 66.29,-0.25 66.29,44.7
  pour Bottom: -0.51,44.96 -0.51,-0.51 66.55,-0.51 66.55,44.96
LOAD_CELL_AMPLIFIED
  Top 0.254: J1.2 45.05,25.78 21.5,25.78 R2.2 18.18,24.85 U2.4
N$1
  Top 0.254: R2.1 | R2.1 20.58,22.18 R1.2 | R2.1 U2.3
N$2
  Top 0.254: U3.1 13.31,11.85 R4.2
N$3
  Top 0.254: U3.6 9.59,15.37 10.07,15.85 10.07,19.56 12.1,21.59 R13.1
N$4
  Top 0.254: U3.8 8.57,13.34 7.33,13.34 R4.1
N$6
  Top 0.254: U2.1 15.86,23.16 15.15,22.45 | 15.15,22.45 14.57,21.86 R13.2 | 15.15,22.45 16,21.59 R12.1
N$7
  Top 0.254: JP3.2 JP4.1 18.92,12.66 17.02,12.66 16.26,13.42 R5.1 16.04,14.1 U3.2
N$9
  Top 0.254: U3.3 16.04,15.37 R5.2 16.34,15.49 18.03,15.49 | JP1.2 18.03,15.49 | 18.03,15.49 JP2.1
POSTINTERLOCK
  Top 0.508: J1.6 53.37,11.65 55.46,11.65 56.77,12.95 56.77,25.67 49.3,33.13 J2.1
PREINTERLOCK
  Top 0.508: J1.5 50.63,12.23 52.45,10.41 56.01,10.41 57.78,12.19 57.78,27.65 52.3,33.13 J2.2
SIGNAL+
  Top 0.254: JP1.1 JP3.1 23.37,14.82 28.45,14.82 J3.3
SIGNAL-
  Top 0.254: JP2.2 JP4.2 30.52,11.85 31.11,12.45 J3.4
SUS_POT_1
  Top 0.254: U5.1 5.98,20.4 6.66,21.08 8.09,21.08 R7.2 9.95,22.39 10.41,22.86 10.41,26.2 11.14,26.92 19.19,26.92 24.34,32.07 32.7,32.07 J4.2
SUS_POT_1_24V
  Top 0.254: U5.3 U5.4 3.67,17.7 3.67,9.41 9.65,3.43 34.29,3.43 48.04,17.18 J1.3
SUS_POT_2
  Top 0.254: U4.1 5.48,25.96 R3.2 8.79,29.27 J5.3
SUS_POT_2_24V
  Top 0.254: J1.4 47.05,15.18 34.8,2.92 9.4,2.92 2.78,9.54 2.78,21 U4.4 U4.3

### Text on the board
bPlace: Corner Board rev3 / Designed by: / Liwei Sun / Shayan Noorani / Mikhail Allen / Brendan Bassett / Ivan Mix / Jessica Ly